# Altium schematic sheet MCU2.SchDoc
size A4
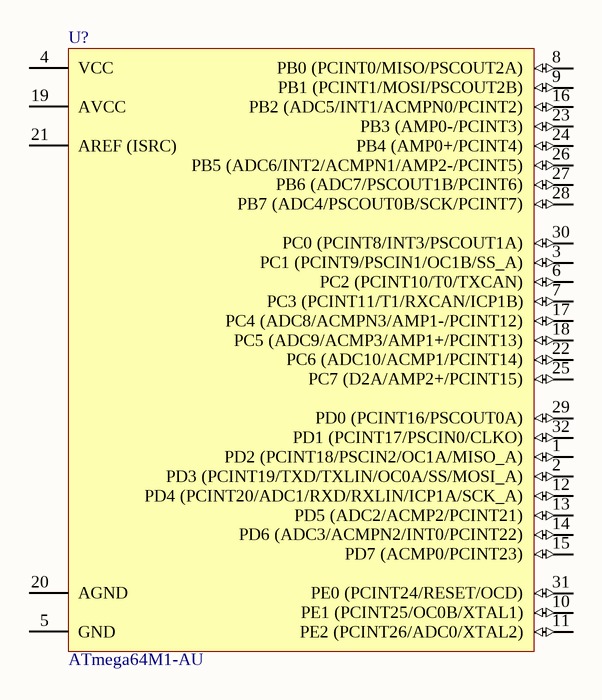
[diagram p0: MCU2.SchDoc]

## Parts
U?  ATmega64M1-AU  [32A_L]

## Nets

Not connected (* = marked no-connect by the designer): U? 1(PD2_(PCINT18/PSCIN2/OC1A/MISO_A)) 2(PD3_(PCINT19/TXD/TXLIN/OC0A/SS/MOSI_A)) 3(PC1_(PCINT9/PSCIN1/OC1B/SS_A)) 4(VCC) 5(GND) 6(PC2_(PCINT10/T0/TXCAN)) 7(PC3_(PCINT11/T1/RXCAN/ICP1B)) 8(PB0_(PCINT0/MISO/PSCOUT2A)) 9(PB1_(PCINT1/MOSI/PSCOUT2B)) 10(PE1_(PCINT25/OC0B/XTAL1)) 11(PE2_(PCINT26/ADC0/XTAL2)) 12(PD4_(PCINT20/ADC1/RXD/RXLIN/ICP1A/SCK_A)) 13(PD5_(ADC2/ACMP2/PCINT21)) 14(PD6_(ADC3/ACMPN2/INT0/PCINT22)) 15(PD7_(ACMP0/PCINT23)) 16(PB2_(ADC5/INT1/ACMPN0/PCINT2)) 17(PC4_(ADC8/ACMPN3/AMP1-/PCINT12)) 18(PC5_(ADC9/ACMP3/AMP1+/PCINT13)) 19(AVCC) 20(AGND) 21(AREF_(ISRC)) 22(PC6_(ADC10/ACMP1/PCINT14)) 23(PB3_(AMP0-/PCINT3)) 24(PB4_(AMP0+/PCINT4)) 25(PC7_(D2A/AMP2+/PCINT15)) 26(PB5_(ADC6/INT2/ACMPN1/AMP2-/PCINT5)) 27(PB6_(ADC7/PSCOUT1B/PCINT6)) 28(PB7_(ADC4/PSCOUT0B/SCK/PCINT7)) 29(PD0_(PCINT16/PSCOUT0A)) 30(PC0_(PCINT8/INT3/PSCOUT1A)) 31(PE0_(PCINT24/RESET/OCD)) 32(PD1_(PCINT17/PSCIN0/CLKO))

## Notes on the sheet
- Title
- Size:
- Date:
- A4
- Number:
- Time:
- Revision:
- Sheet
- of
- File:

## Library data of the parts
U? = ATmega64M1-AU: 8-bit AVR Microcontroller, 64KB Flash, 2KB EEPROM, 4KB SRAM, Industrial Grade (-40° to +85°C), 32-Pin TQFP; Published: 1-Apr-2010; DatasheetVersion: revB, Oct-2009; PackageVersion: revB, Oct-2001; PackageReference: 32A; Publisher: Altium Limited; PackageDescription: 32-Lead, 7x7x1.0 mm Body, 0.8mm Lead Pitch, Thin Profile Plastic Quad Flat Package (TQFP); Supplier 1: Digi-Key; Supplier Part Number 1: ATMEGA64M1-AU-ND; Supplier 2: Mouser; Supplier Part Number 2: 556-ATMEGA64M1-AU; Code_JEDEC: MS-026-ABA; ComponentLink1Description: Manufacturer Link; ComponentLink1URL: http://www.atmel.com/products/avr/default.asp?; ComponentLink2Description: ATmega16M1/32M1/64M1 Datasheet; ComponentLink2URL: http://www.atmel.com/dyn/resources/prod_documents/doc8209.pdf; ComponentLink3Description: ATmega16M1/32M1/64M1 Summary; ComponentLink3URL: http://www.atmel.com/dyn/resources/prod_documents/8209S.pdf; ComponentLink4Description: Atmel.com Home; ComponentLink4URL: http://www.atmel.com